# EasyEDA schematic SCH_M5 Stick BrownHat_2022-11-10.json
TITLE: BrownHat; REV: 1.0; Date: 2022-09-08; Sheet: 1/1; Drawn By: Hans Tanner; Company: IoTT - Internet of Toy Trains
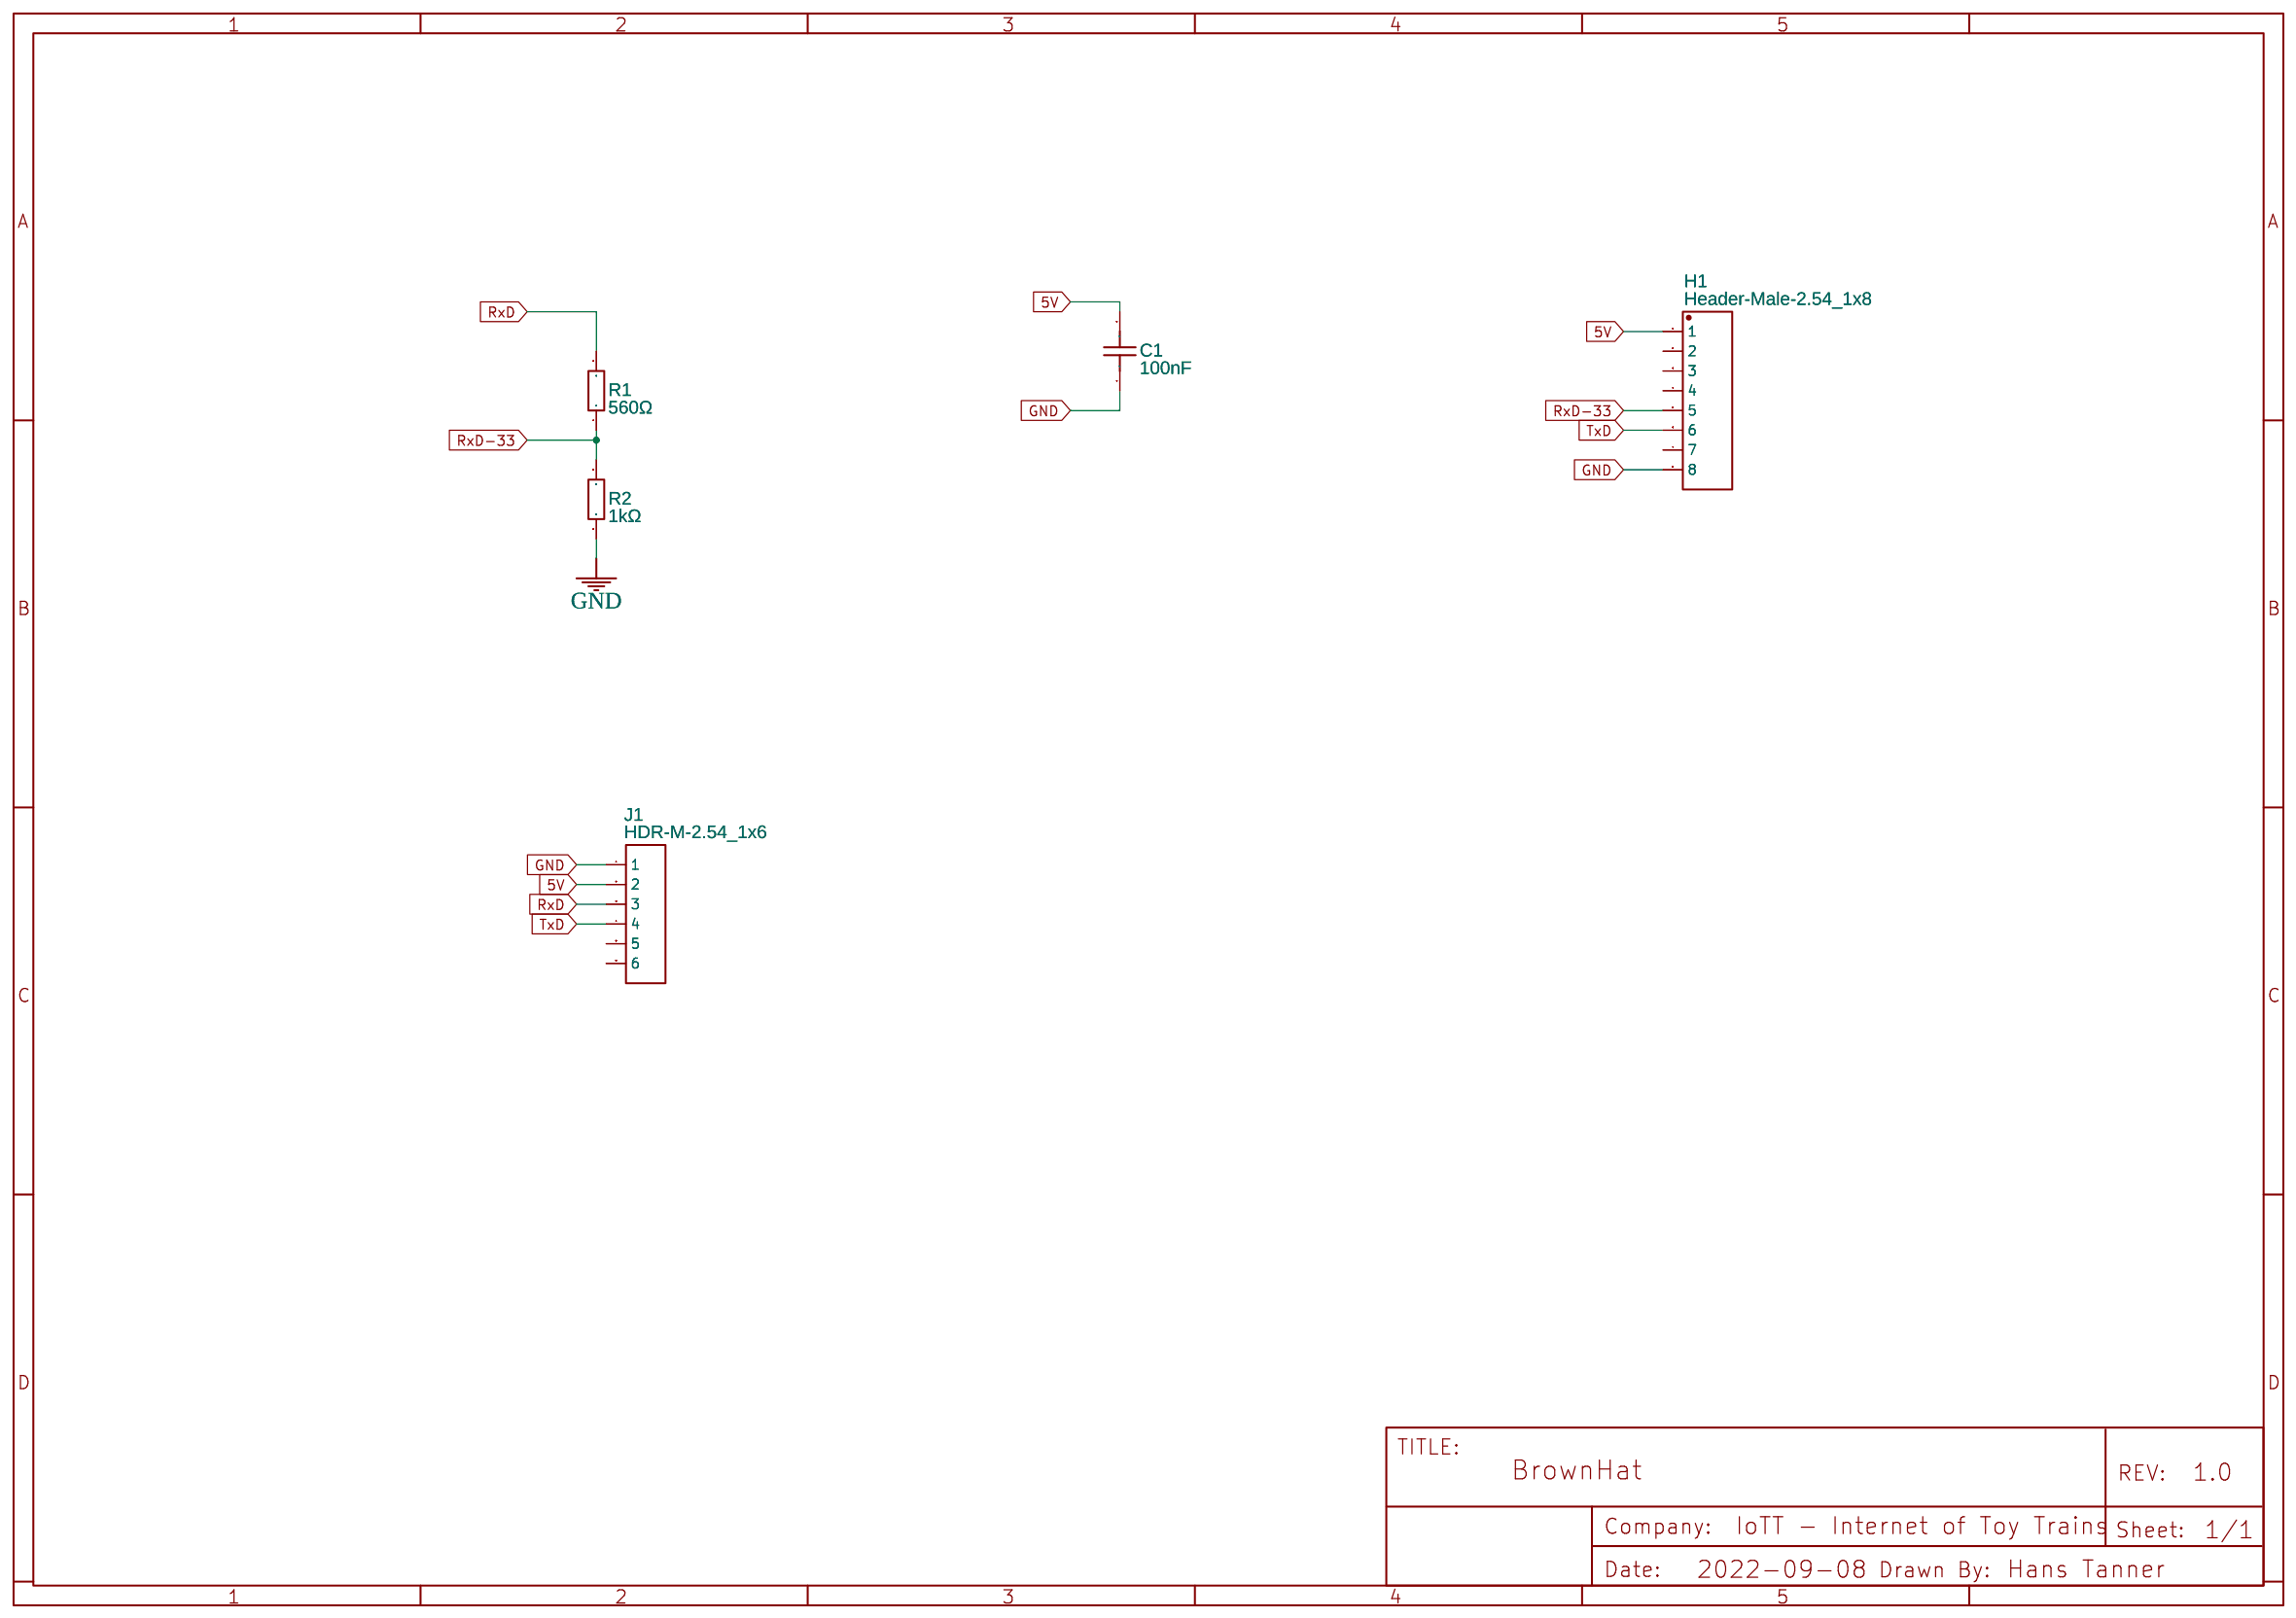
[diagram p0: schematic sheet]

## Parts
C1  100nF  [C0603]
H1  Header-Male-2.54_1x8  [210S-1X8P]
J1  HDR-M-2.54_1x6  [HDR-M-2.54_1X6]
R1  560Ω  [R0603]
R2  1kΩ  [R0402]

## Library data of the parts
C1 = CC0603KRX7R9BB104: Supplier: LCSC; Manufacturer: YAGEO; Supplier Part: C14663; JLCPCB Part Class: Basic Part
H1 = Header-Male-2.54_1x8: Supplier: LCSC; Manufacturer: Ckmtw; Manufacturer Part: 210S-1*8P L=11.6MMGold-plated black; Contributor: LCSC; Supplier Part: C124381
J1 = HDR-M-2.54_1x6: Supplier Part: C190819; Supplier: LCSC; Contributor: LCEDA_Lib
R1 = 0603WAF5600T5E: Supplier: LCSC; Manufacturer: UniOhm; Supplier Part: C23204; Resistance (Ohms): 560; JLCPCB Part Class: Basic Part
R2 = 0402WGF1001TCE: Supplier: LCSC; Manufacturer: UniOhm; Supplier Part: C11702; Resistance (Ohms): 1K; JLCPCB Part Class: Basic Part

## Nets
5V: C1.2 H1.1 J1.2
GND: C1.1 H1.8 J1.1 R2.1
RxD: J1.3 R1.2
RxD-33: H1.5 R1.1 R2.2
TxD: H1.6 J1.4

Not connected (* = marked no-connect by the designer): H1 2 3 4 7; J1 5 6
